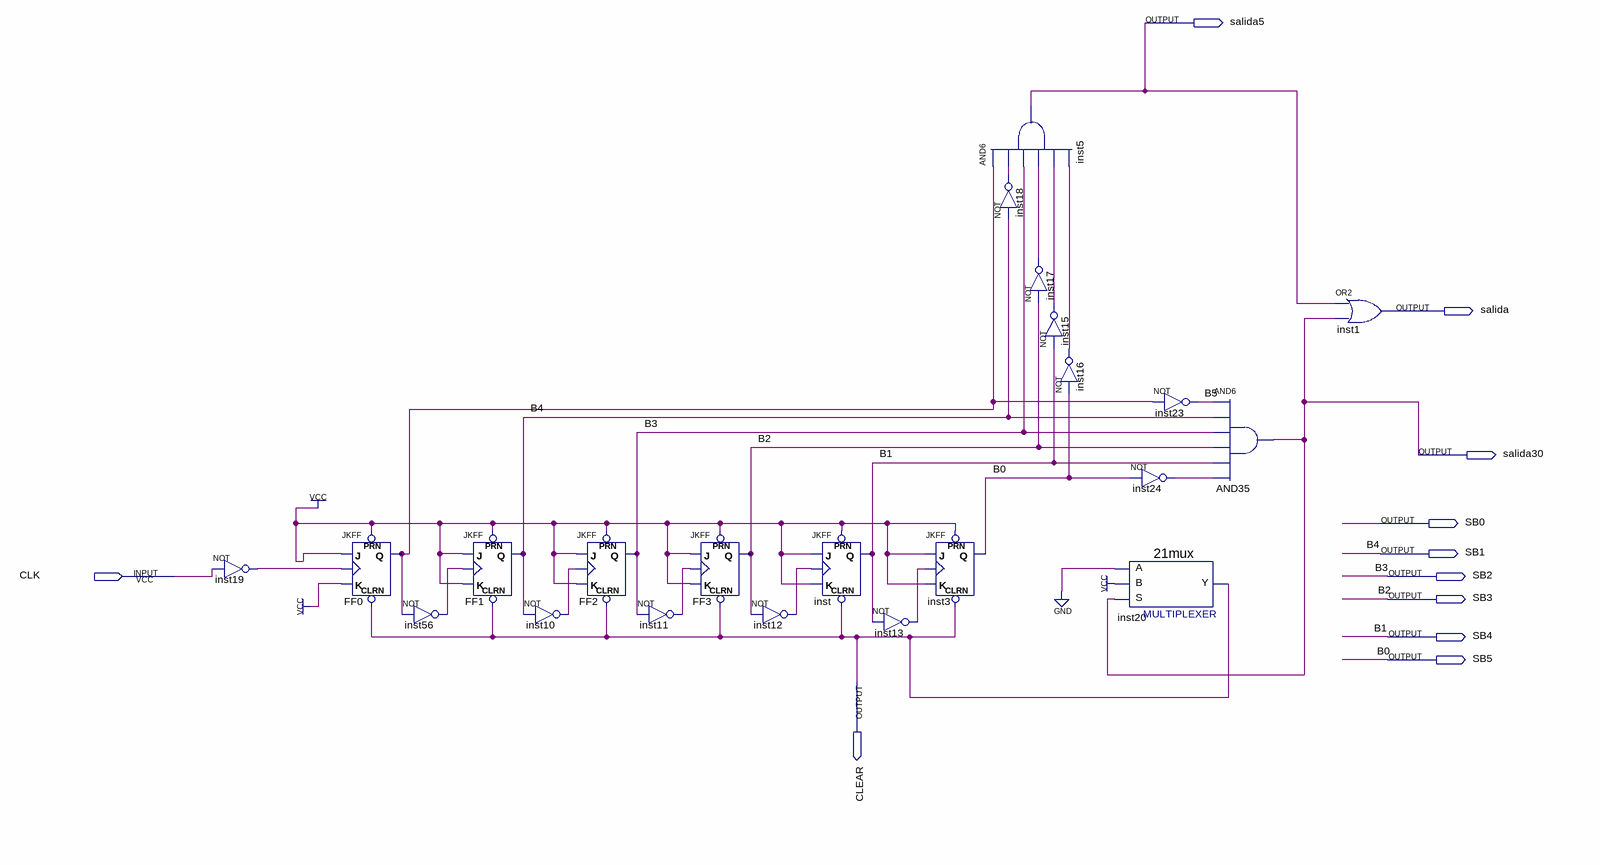
[diagram p0: schematic sheet]
// Quartus schematic contadorUnico.bdf as structural Verilog: 22 symbols, 11 pins
module contadorUnico (
  input  CLK,
  output salida5,
  output salida,
  output salida30,
  output SB0,
  output SB1,
  output SB2,
  output SB3,
  output SB4,
  output SB5,
  output CLEAR
);

  wire B5, FF0_q, inst10_out, inst11_out, inst12_out, inst13_out, inst15_out, inst16_out, inst17_out,
       inst18_out, inst19_out, inst24_out, inst56_out;

  not inst19 (inst19_out, CLK);
  JKFF FF0 (.PRN(1'b1), .CLRN(CLEAR), .K(1'b1), .J(1'b1), .CLK(inst19_out), .Q(FF0_q));
  not inst56 (inst56_out, FF0_q);
  JKFF FF1 (.PRN(1'b1), .CLRN(CLEAR), .K(1'b1), .J(1'b1), .CLK(inst56_out), .Q(SB1));
  not inst10 (inst10_out, SB1);
  JKFF FF2 (.PRN(1'b1), .CLRN(CLEAR), .K(1'b1), .J(1'b1), .CLK(inst10_out), .Q(SB2));
  not inst11 (inst11_out, SB2);
  JKFF FF3 (.PRN(1'b1), .CLRN(CLEAR), .K(1'b1), .J(1'b1), .CLK(inst11_out), .Q(SB3));
  not inst12 (inst12_out, SB3);
  JKFF inst (.PRN(1'b1), .CLRN(CLEAR), .K(1'b1), .J(1'b1), .CLK(inst12_out), .Q(SB4));
  not inst13 (inst13_out, SB4);
  and inst5 (salida5, FF0_q, inst18_out, SB2, inst17_out, inst15_out, inst16_out);
  JKFF inst3 (.PRN(1'b1), .CLRN(CLEAR), .K(1'b1), .J(1'b1), .CLK(inst13_out), .Q(SB5));
  not inst18 (inst18_out, SB1);
  not inst17 (inst17_out, SB3);
  not inst15 (inst15_out, SB4);
  not inst16 (inst16_out, SB5);
  not inst23 (B5, FF0_q);
  not inst24 (inst24_out, SB5);
  \21mux  inst20 (.S(salida30), .B(1'b1), .A(1'b0), .Y(CLEAR));
  and AND35 (salida30, B5, SB1, SB2, SB3, SB4, inst24_out);
  or inst1 (salida, salida5, salida30);

  // Other names for the same wires on the sheet: B0 = SB5; B1 = SB4; B2 = SB3; B3 = SB2; B4 = SB1
endmodule
